# EAGLE design Balancer 4S (EAGLE 7.7.0)
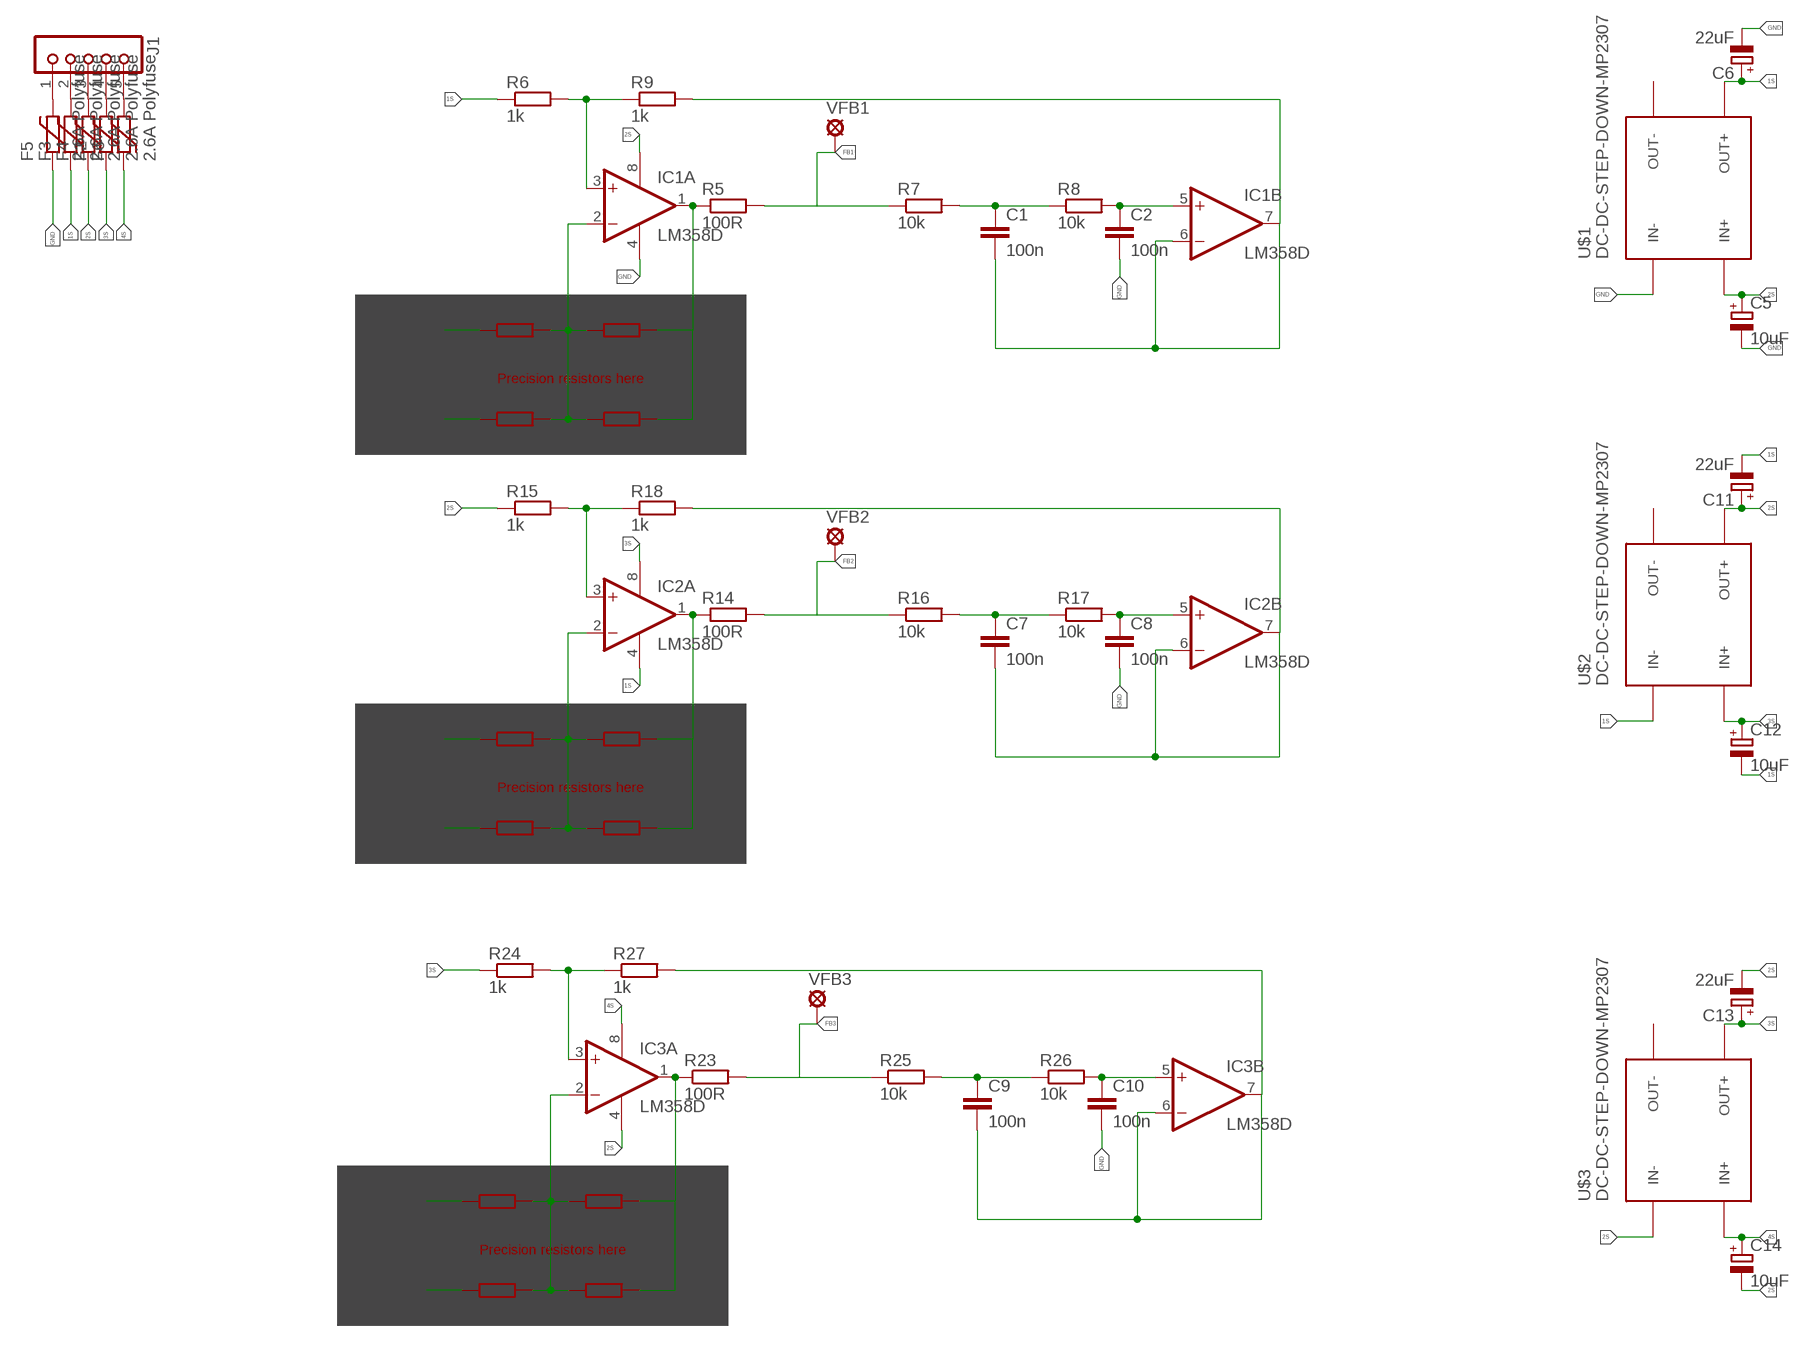
[diagram p0: schematic, sheet 1]

## Parts
C1  100n  C-EUC0805K  [C0805K]
C2  100n  C-EUC0805K  [C0805K]
C5  10uF  CPOL-EUE2,5-6E  [E2,5-6E]
C6  22uF  CPOL-EUE2,5-6E  [E2,5-6E]
C7  100n  C-EUC0805K  [C0805K]
C8  100n  C-EUC0805K  [C0805K]
C9  100n  C-EUC0805K  [C0805K]
C10  100n  C-EUC0805K  [C0805K]
C11  22uF  CPOL-EUE2,5-6E  [E2,5-6E]
C12  10uF  CPOL-EUE2,5-6E  [E2,5-6E]
C13  22uF  CPOL-EUE2,5-6E  [E2,5-6E]
C14  10uF  CPOL-EUE2,5-6E  [E2,5-6E]
F2  2.6A Polyfuse  1812L  [1812L]
F3  2.6A Polyfuse  1812L  [1812L]
F4  2.6A Polyfuse  1812L  [1812L]
F5  2.6A Polyfuse  1812L  [1812L]
F6  2.6A Polyfuse  1812L  [1812L]
IC1  LM358D  [SO08]
IC2  LM358D  [SO08]
IC3  LM358D  [SO08]
J1  JU05  [JU05]
R1  1k  R-EU_0204/7  [0204/7]
R2  1k  R-EU_0204/7  [0204/7]
R3  1k  R-EU_0204/7  [0204/7]
R4  1k  R-EU_0204/7  [0204/7]
R5  100R  R-EU_M0805  [M0805]
R6  1k  R-EU_M0805  [M0805]
R7  10k  R-EU_M0805  [M0805]
R8  10k  R-EU_M0805  [M0805]
R9  1k  R-EU_M0805  [M0805]
R10  1k  R-EU_0204/7  [0204/7]
R11  1k  R-EU_0204/7  [0204/7]
R12  1k  R-EU_0204/7  [0204/7]
R13  1k  R-EU_0204/7  [0204/7]
R14  100R  R-EU_M0805  [M0805]
R15  1k  R-EU_M0805  [M0805]
R16  10k  R-EU_M0805  [M0805]
R17  10k  R-EU_M0805  [M0805]
R18  1k  R-EU_M0805  [M0805]
R19  1k  R-EU_0204/7  [0204/7]
R20  1k  R-EU_0204/7  [0204/7]
R21  1k  R-EU_0204/7  [0204/7]
R22  1k  R-EU_0204/7  [0204/7]
R23  100R  R-EU_M0805  [M0805]
R24  1k  R-EU_M0805  [M0805]
R25  10k  R-EU_M0805  [M0805]
R26  10k  R-EU_M0805  [M0805]
R27  1k  R-EU_M0805  [M0805]
U$1  DC-DC-STEP-DOWN-MP2307  [DC-DC-STEP-DOWN-MP2307]
U$2  DC-DC-STEP-DOWN-MP2307  [DC-DC-STEP-DOWN-MP2307]
U$3  DC-DC-STEP-DOWN-MP2307  [DC-DC-STEP-DOWN-MP2307]
VFB1  MCS08  [MCS08]
VFB2  MCS08  [MCS08]
VFB3  MCS08  [MCS08]

## Nets
1S: C6.+ C11.- C12.- F3.P$1 IC2.4(P:V-) R6.1 R12.1 U$1.OUT+ U$2.IN-
2S: C5.+ C11.+ C13.- C14.- F4.P$1 IC1.8(P:V+) IC3.4(P:V-) R1.1 R15.1 R21.1 U$1.IN+ U$2.OUT+ U$3.IN-
3S: C12.+ C13.+ F2.P$1 IC2.8(P:V+) R10.1 R24.1 U$2.IN+ U$3.OUT+
4S: C14.+ F6.P$1 IC3.8(P:V+) R19.1 U$3.IN+
FB1: R5.2 R7.1 VFB1.MP
FB2: R14.2 R16.1 VFB2.MP
FB3: R23.2 R25.1 VFB3.MP
GND: C2.2 C5.- C6.- C8.2 C10.2 F5.P$1 IC1.4(P:V-) R3.1 U$1.IN-
N$1: IC1.3(A:+IN) R6.2 R9.1
N$2: F5.P$2 J1.1
N$3: IC1.2(A:-IN) R1.2 R2.1 R3.2 R4.1
N$4: IC1.1(A:OUT) R2.2 R4.2 R5.1
N$5: C1.1 R7.2 R8.1
N$6: C2.1 IC1.5(B:+IN) R8.2
N$7: C1.2 IC1.6(B:-IN) IC1.7(B:OUT) R9.2
N$8: F4.P$2 J1.3
N$9: F3.P$2 J1.2
N$10: F2.P$2 J1.4
N$11: F6.P$2 J1.5
N$12: IC2.3(A:+IN) R15.2 R18.1
N$13: IC2.2(A:-IN) R10.2 R11.1 R12.2 R13.1
N$14: IC2.1(A:OUT) R11.2 R13.2 R14.1
N$17: C7.1 R16.2 R17.1
N$18: C8.1 IC2.5(B:+IN) R17.2
N$19: C7.2 IC2.6(B:-IN) IC2.7(B:OUT) R18.2
N$20: IC3.3(A:+IN) R24.2 R27.1
N$21: IC3.2(A:-IN) R19.2 R20.1 R21.2 R22.1
N$22: IC3.1(A:OUT) R20.2 R22.2 R23.1
N$23: C9.1 R25.2 R26.1
N$24: C10.1 IC3.5(B:+IN) R26.2
N$25: C9.2 IC3.6(B:-IN) IC3.7(B:OUT) R27.2
Unconnected: U$1.OUT- U$2.OUT- U$3.OUT-

## Notes on the sheet
- Precision resistors here
- Precision resistors here
- Precision resistors here | Precision resistors here | Precision resistors here | Precision resistors here | Precision resistors here | Precision resistors here | Precision resistors here | Precision resistors here | Precision resistors here | Precision resistors here | Precision resistors here | Precision resistors here
- Precision resistors here
- Precision resistors here
- Precision resistors here | Precision resistors here | Precision resistors here | Precision resistors here | Precision resistors here | Precision resistors here | Precision resistors here | Precision resistors here | Precision resistors here | Precision resistors here | Precision resistors here | Precision resistors here
- Precision resistors here
- Precision resistors here
- Precision resistors here | Precision resistors here | Precision resistors here | Precision resistors here | Precision resistors here | Precision resistors here | Precision resistors here | Precision resistors here | Precision resistors here | Precision resistors here | Precision resistors here | Precision resistors here

## Library data of the parts
C1 C2 C7-C10 = rcl:C-EU: CAPACITOR, European symbol
C5 C6 C11-C14 = rcl:CPOL-EU: POLARIZED CAPACITOR, European symbol
F2-F6 = ptc-littlefuse:1812L
IC1-IC3 = linear:LM358: OP AMP also LM158; LM258; LM2904 Source: http://cache.national.com/ds/LM/LM158.pdf
J1 = con-lsta:JU05: PIN HEADER; OC_FARNELL: unknown; OC_NEWARK: unknown
R1-R4 R10-R13 R19-R22 = resistor:R-EU_: RESISTOR, European symbol
R5-R9 R14-R18 R23-R27 = rcl:R-EU_: RESISTOR, European symbol
U$1-U$3 = diy-modules:DC-DC-STEP-DOWN-MP2307: DC/DC Step-Down Regulator based on MP2307DN chip MP2307 datasheet available here: https://cdn-shop.adafruit.com/datasheets/MP2307_r1.9.pdf Click here to find device on ebay.com <http://www.ebay.com/sch/dc+dc+3a+mini+converter>
VFB1-VFB3 = solpad:MCS08: SOLDER PAD MC S0,8, drill 1.2 mm, distributor Buerklin, 08F130

## Net classes
0 default: width 0.254 mm, drill 0.55 mm, clearance 0.381 mm

## Board
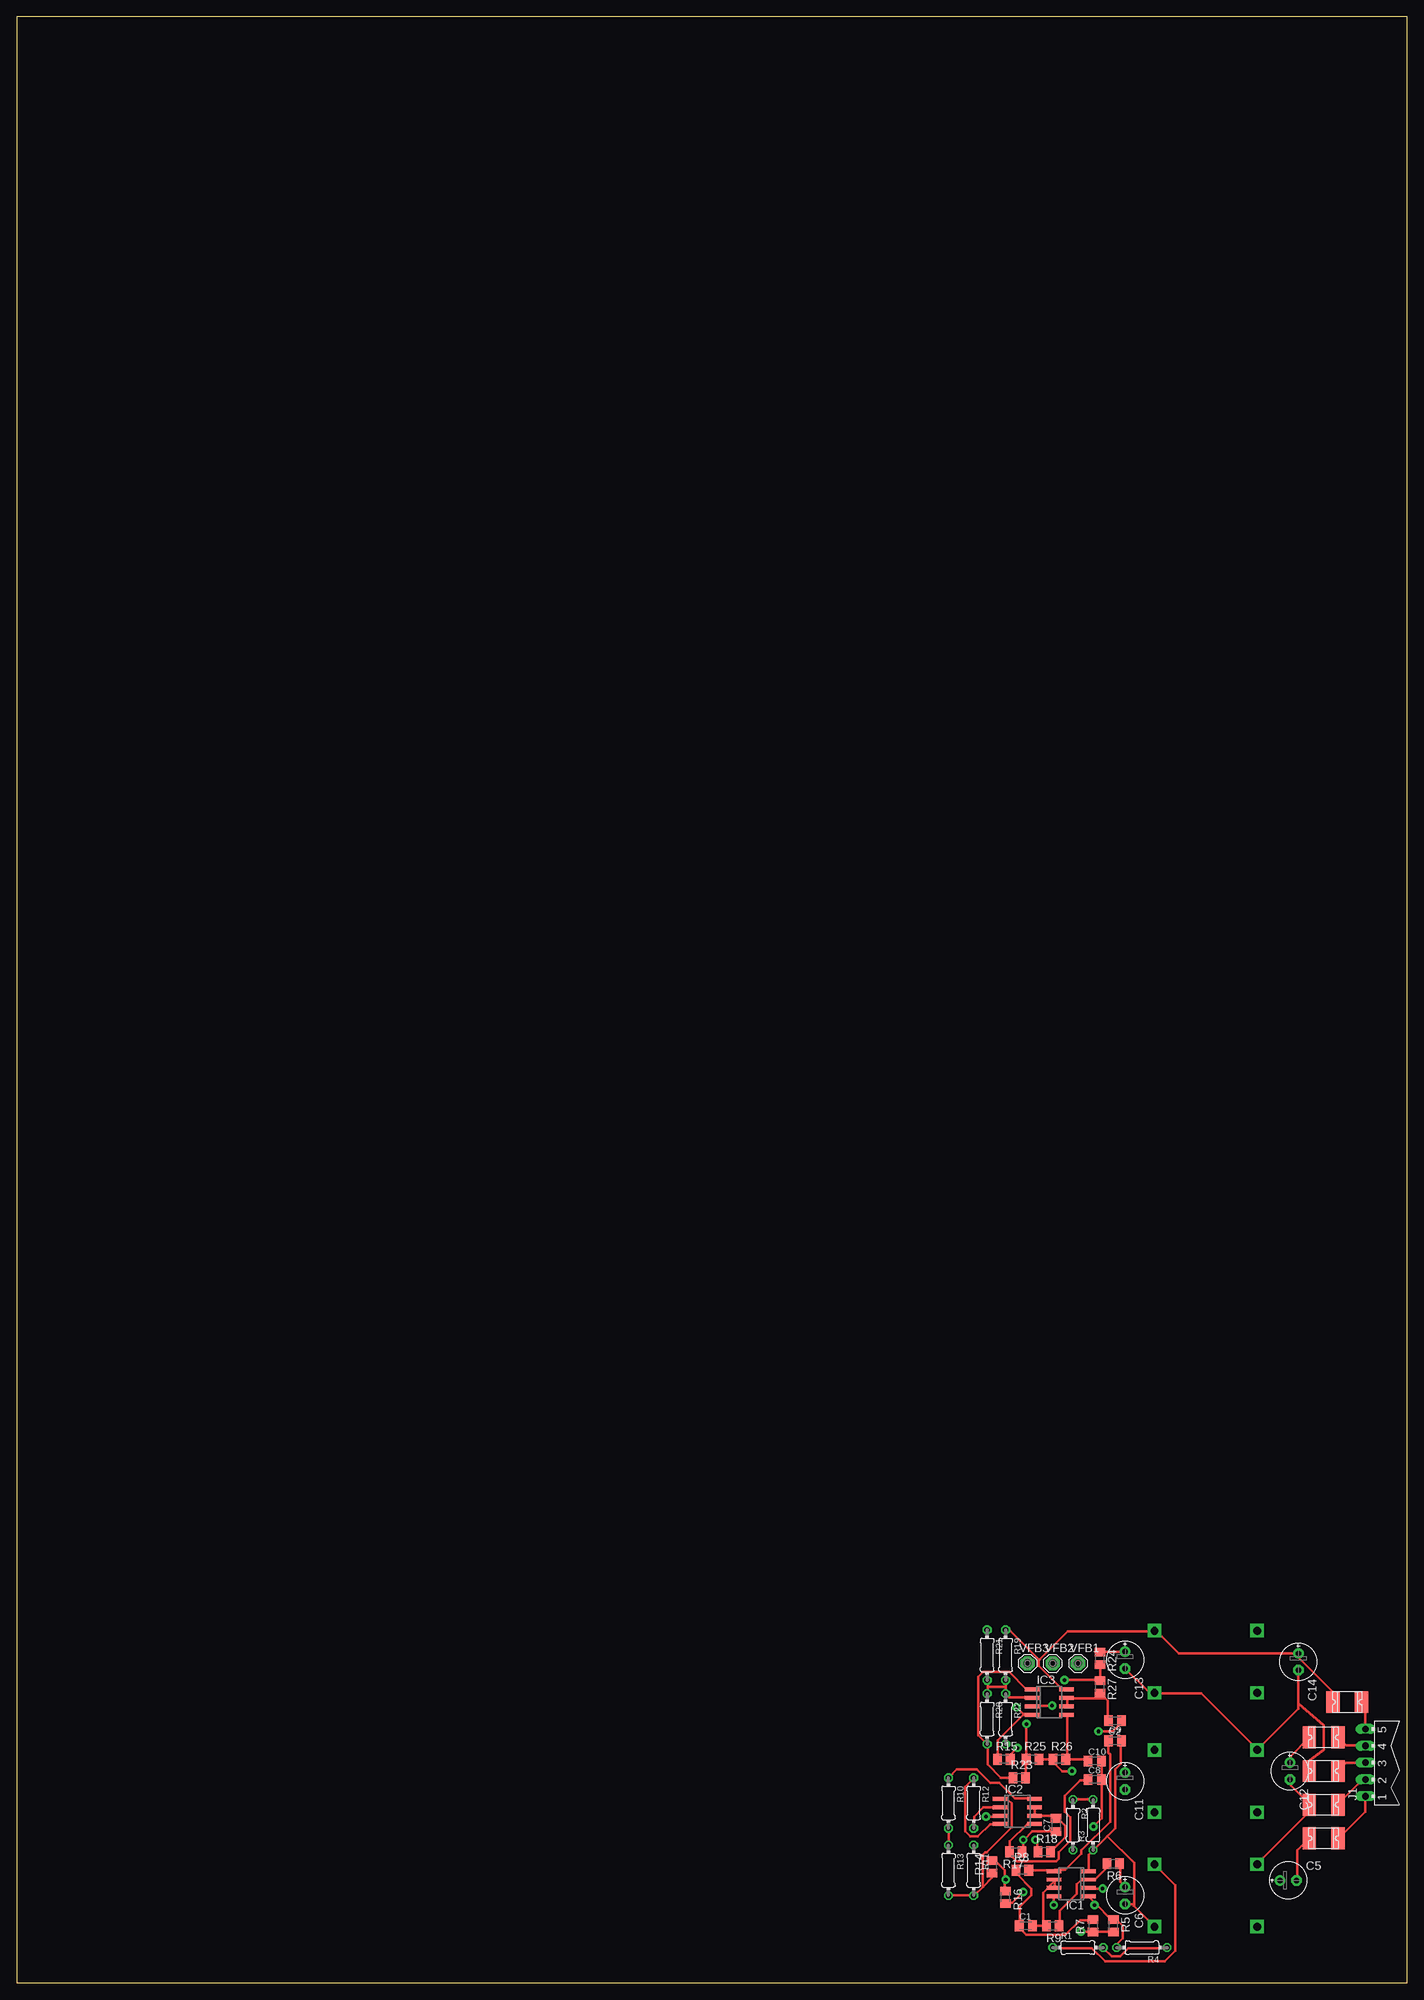
[diagram p1: board, top side]
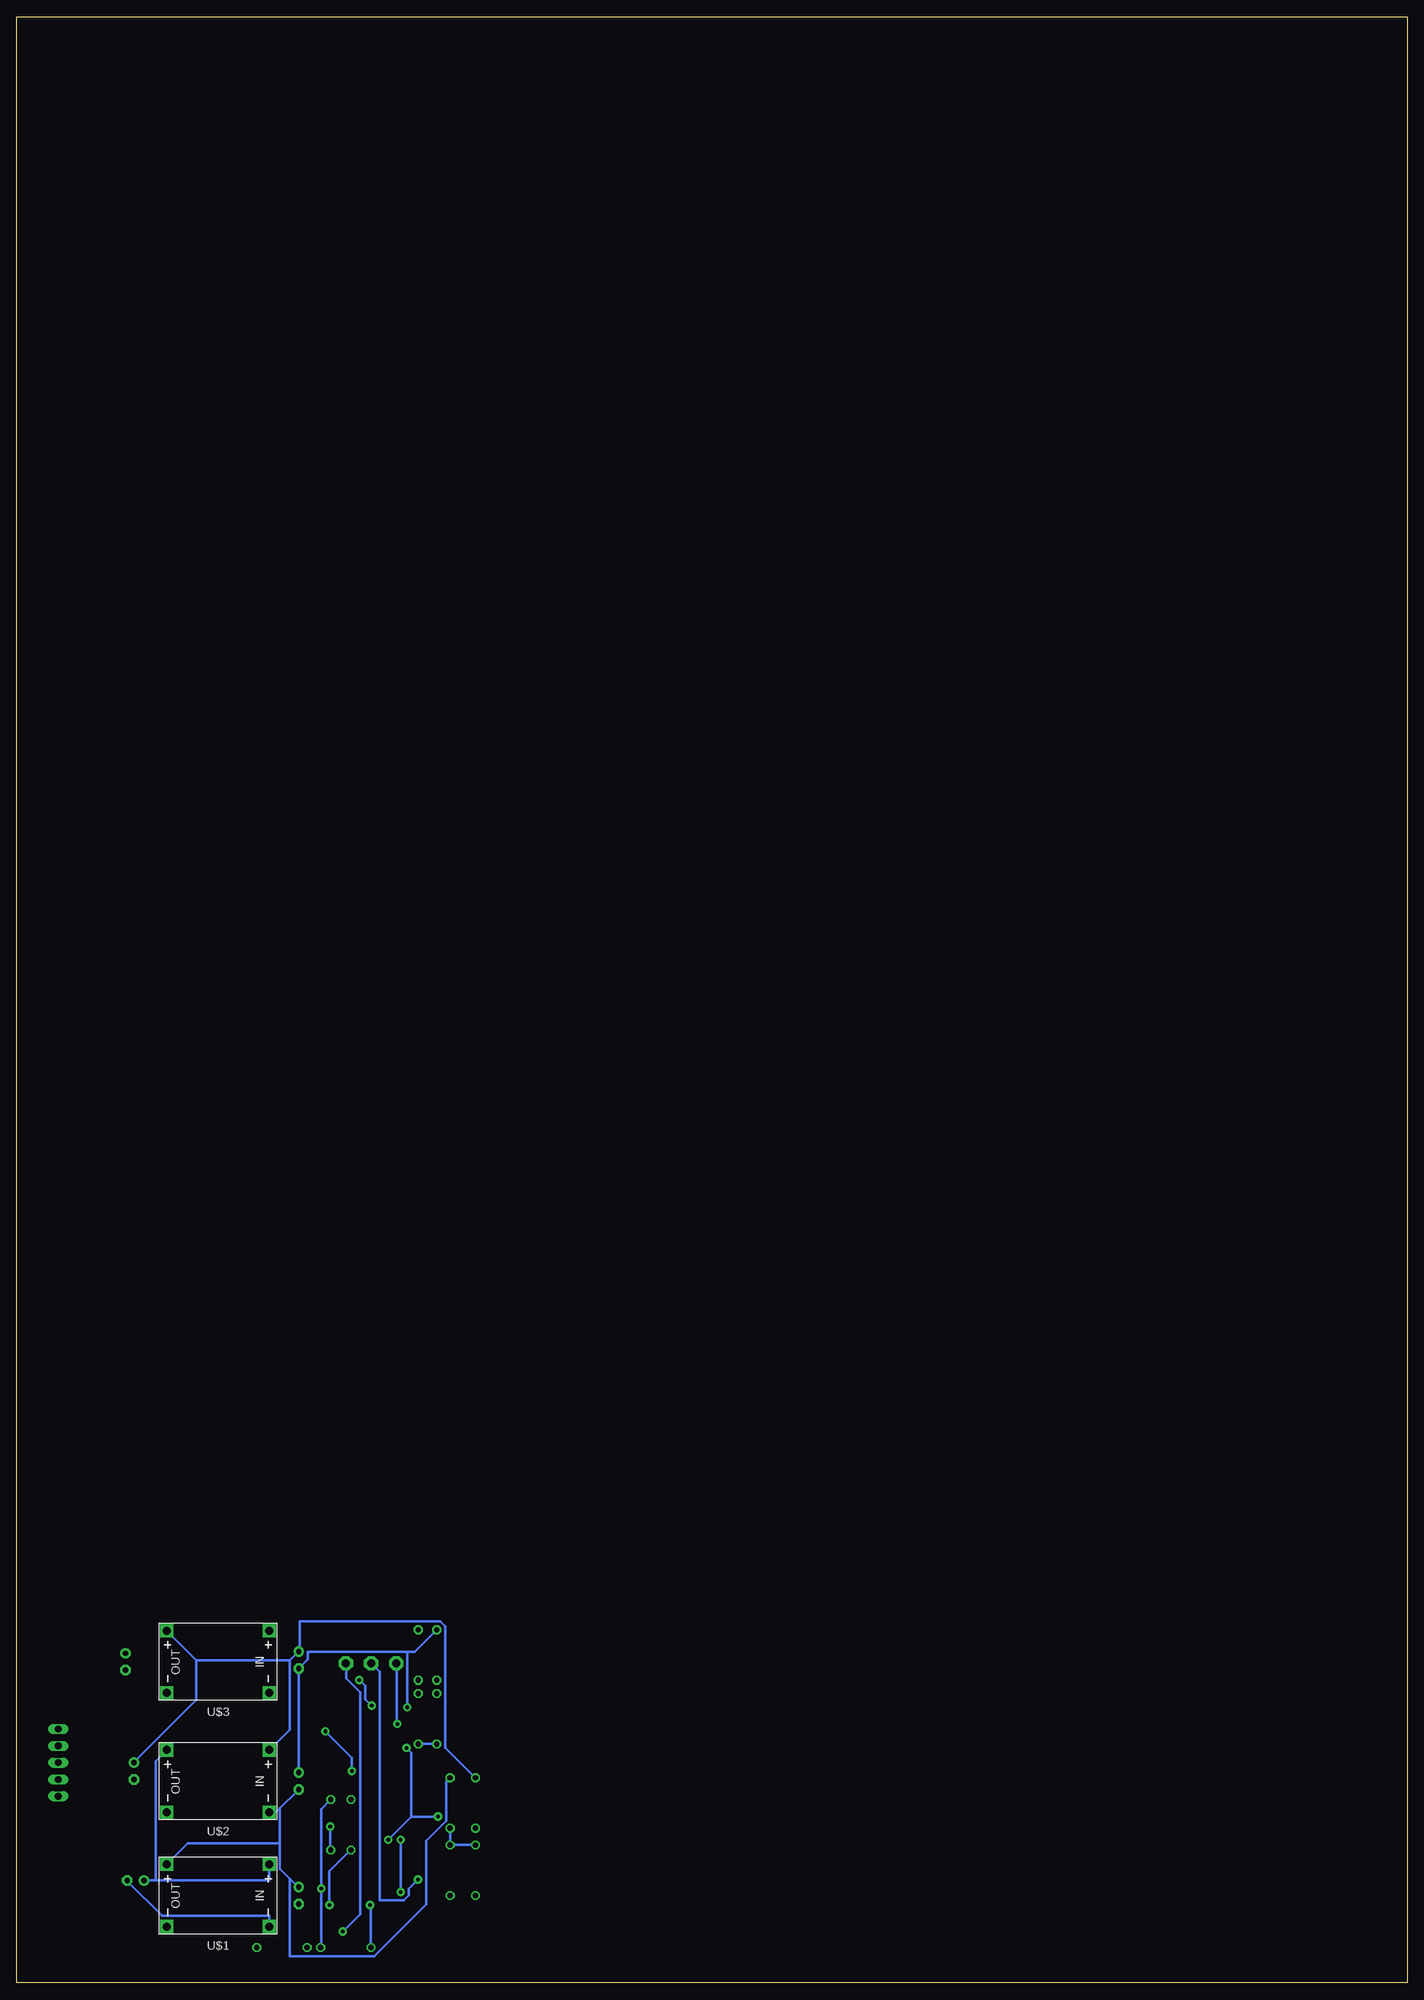
[diagram p2: board, bottom side, seen from below]

Size 210 x 297 mm. Coordinates in mm from the lower left corner, seen from the top.
Outline: 0,0 210,0 210,297 0,297 0,0
Copper layers (1*16): Top 0.035mm / dielectric 1.5mm / Bottom 0.035mm
Design rules "default *": minimum track width 0.35mm, minimum drill 0.526mm, track to track 0.3mm, track to pad 0.35mm, pad to pad 0.3mm, via to via 0.35mm, smd to smd 8mil, copper to edge 40mil, drill to drill 8mil, minimum pad ring 10mil, minimum via ring 0.35mm, stop-mask expansion 4mil, vias tented up to drill 0mil, thermal gap 10mil

### Footprints (pad centres in the part's own frame; a part is rotated, then mirrored left to right if it is on the bottom)
C0805K = smd 1.3 x 1.6: 1 -1,0; 2 1,0
E2,5-6E = drill 0.813 pad 1.575: + -1.27,0 | drill 0.813 pad 1.575 octagon: - 1.27,0
1812L = smd 2.03 x 3.3: P$1 -2.16,0; P$2 2.16,0
SO08 = smd 0.6 x 2.2: 1 -1.905,-2.6; 2 -0.635,-2.6; 3 0.635,-2.6; 4 1.905,-2.6; 5 1.905,2.6; 6 0.635,2.6; 7 -0.635,2.6; 8 -1.905,2.6
JU05 = drill 1.016 long: 1 -5.08,0; 2 -2.54,0; 3 0,0; 4 2.54,0; 5 5.08,0
0204/7 = drill 0.813 octagon: 1 -3.81,0; 2 3.81,0
M0805 = smd 1.3 x 1.6: 1 -0.95,0; 2 0.95,0
DC-DC-STEP-DOWN-MP2307 = drill 1.2 pad 2 square: IN+ -7.747,-4.699; IN- -7.747,4.699; OUT+ 7.747,-4.699; OUT- 7.747,4.699
MCS08 = drill 1.194 pad 2.159 octagon: MP 0,0

### Placement (x,y rotation side)
C1  152.4,8.64 0 top
C2  165.86,36.58 0 top
C5  192.02,15.49 0 top
C6  167.39,13.21 270 top
C7  156.97,23.88 90 top
C8  162.81,30.73 0 top
C9  165.86,39.62 180 top
C10  162.81,33.53 0 top
C11  167.39,30.48 270 top
C12  192.28,32 270 top
C13  167.39,48.77 270 top
C14  193.55,48.51 270 top
F2  197.36,37.08 0 top
F3  197.36,26.92 0 top
F4  197.36,32 0 top
F5  197.36,21.84 0 top
F6  200.91,42.42 0 top
IC1  159.26,14.99 90 top
IC2  151.13,25.91 270 top
IC3  155.96,42.42 270 top
J1  203.71,33.27 90 top
R1  160.27,5.33 0 top
R2  159.51,23.88 270 top
R3  162.56,23.88 90 top
R4  169.93,5.33 180 top
R5  165.61,8.64 270 top
R6  165.61,18.03 180 top
R7  162.56,8.64 90 top
R8  151.89,17.02 0 top
R9  156.46,8.64 180 top
R10  140.72,27.18 270 top
R11  144.53,17.02 270 top
R12  144.53,27.18 270 top
R13  140.72,17.02 270 top
R14  147.32,17.53 90 top
R15  149.1,33.78 0 top
R16  149.35,12.95 270 top
R17  150.88,19.81 180 top
R18  155.19,19.81 0 top
R19  149.35,49.53 270 top
R20  146.56,39.88 270 top
R21  146.56,49.53 270 top
R22  149.35,39.88 270 top
R23  151.38,30.99 0 top
R24  163.58,49.02 270 top
R25  153.42,33.78 0 top
R26  157.48,33.78 0 top
R27  163.58,44.7 270 top
U$1  179.58,13.21 180 bottom
U$2  179.58,30.48 180 bottom
U$3  179.58,48.51 180 bottom
VFB1  160.27,48.26 0 top
VFB2  156.46,48.26 0 top
VFB3  152.65,48.26 0 top

### Tracks (layer width: path | path; a pad name or v marks a point on that pad's centre or on a via)
1S
  Top 0.35: C12.- 192.38,30.62 192.38,29.88 195.12,27.12 F3.P$1 195,25.88 195,25.62 187.38,18 U$1.OUT+ | IC2.4 148.5,24 147,24 145.12,22.12 144,22.12 143.25,22.88 143.25,29.62 144.5,30.88 R12.1 | R6.1 166.62,18 166.62,15.25 167.38,14.5 C6.+
  Top 0.508: F3.P$1 195.2,26.04
  Bottom 0.35: 170.31,26.31 170.75,25.88 171.75,25.88 U$2.IN- | 170.31,26.31 167.5,29.12 C11.- | 168.69,15.69 170.25,17.25 170.25,21.12 | 168.69,15.69 167.5,14.5 C6.+ | 170.25,21.12 170.25,26.25 170.31,26.31 | R12.1 144.62,30.88 145.12,30.38 145.12,24.5 148.12,21.5 148.12,11.88 156,4 168.75,4 168.75,15.62 168.69,15.69 | 170.25,21.12 184.12,21.12 187.25,18 U$1.OUT+
2S  (via drill 0.55)
  Top 0.35: 152,40.5 148.12,36.62 148.12,33.88 R15.1 | 152,40.5 153.25,40.5 IC3.4 | C13.- 167.5,47.38 171,43.88 171.75,43.88 U$3.IN- 172,43.75 178.88,43.75 187.25,35.38 U$2.OUT+ 187.38,35.25 193.5,41.38 193.5,42.12 | v151,41.62 152,40.62 152,40.5 | 193.5,42.12 193.5,47.12 C14.- | F4.P$1 195.25,32.12 195.25,33.62 197.38,35.25 197.38,38.88 193.62,42.12 193.5,42.12 | v156.62,11.75 156.62,13 IC1.8 | R1.1 156.5,5.25 162.38,5.25 164.38,3.25 173.38,3.25 175,4.88 175,14.75 171.88,17.88 U$1.IN+
  Bottom 0.35: 151,50 166,50 166,48.88 167.38,47.5 C13.- 167.38,47.38 167.38,31.75 C11.+ | 151,50 149.88,50 146.62,53.25 R21.1 | 151,50 v151,41.62 | v156.62,11.75 156.5,11.62 156.5,5.38 R1.1 | 189,15.5 171.88,15.5 171.88,17.88 U$1.IN+ | 189,15.5 C5.+ | 189,15.5 189,33.5 187.38,35.12 U$2.OUT+
3S
  Top 0.35: IC2.8 153.62,27.88 150.75,27.88 148.38,30.25 147,30.25 145,32.25 142,32.25 140.75,31 R10.1 | C12.+ 192.38,33.38 192.38,34.25 195.12,37 F2.P$1 | R24.1 163.62,50 167.38,50 C13.+
  Bottom 0.35: 168.75,48.75 168.75,38.25 171.75,35.25 U$2.IN+ | 168.75,48.75 167.5,50 C13.+ 167.25,50.12 167.25,54.62 146,54.62 145.25,53.88 145.25,35.5 140.75,31 R10.1 | 182.88,48.75 187.25,53.12 U$3.OUT+ | 168.75,48.75 182.88,48.75 | 182.88,48.75 182.88,42.75 192.25,33.38 C12.+
4S
  Top 0.35: F6.P$1 198.75,42.5 198.75,44 193.62,49.12 193.62,49.75 C14.+ 193.38,49.75 175.5,49.75 172,53.25 U$3.IN+ 171.75,53.12 158.75,53.12 154.5,48.88 154.38,48.88 | 154.38,48.88 154.38,47.88 157.88,44.38 158.5,44.38 IC3.8 | 154.38,48.88 150,53.25 149.38,53.25 R19.1
FB1  (via drill 0.55)
  Top 0.35: R5.2 165.5,7.75 162.62,7.75 R7.1 162.5,7.75 v160.75,7.75
  Bottom 0.35: v160.75,7.75 158.12,10.38 158.12,43.88 160.25,46 160.25,48.25 VFB1.MP
FB2  (via drill 0.55)
  Top 0.35: 149.25,15.62 149.25,17 147.88,18.38 147.38,18.38 R14.2 | 149.25,15.62 149.25,14 R16.1 | v149.38,15.62 149.25,15.62
  Bottom 0.35: v149.38,15.62 150.75,14.25 150.75,13.25 151.5,12.5 155.12,12.5 155.12,47 156.38,48.25 VFB2.MP
FB3  (via drill 0.55)
  Top 0.35: R23.2 152.38,31 152.38,33.75 R25.1 152.5,33.88 v152.5,39.12
  Bottom 0.35: v152.5,39.12 152.62,39.25 152.62,48.25 VFB3.MP
GND  (via drill 0.55)
  Top 0.35: C10.2 163.88,33.5 163.88,30.75 C8.2 163.88,30.62 163.88,24.88 v162.62,23.62 | 164.69,22.19 162.62,20.12 R3.1 162.5,20 161.88,19.38 161.88,17 IC1.4 | 164.69,22.19 165.88,23.38 165.88,32.25 166.75,33.12 166.75,36.5 C2.2 | C5.- 193.38,15.5 193.38,20 195.12,21.75 F5.P$1 | 168.69,11.69 171.75,8.62 U$1.IN- | 168.69,11.69 168.5,11.88 167.5,11.88 C6.- | 164.69,22.19 168.75,18.12 168.75,11.75 168.69,11.69
  Bottom 0.35: v162.62,23.62 162.62,20.12 R3.1 | C5.- 193.25,15.38 188,10.12 171.88,10.12 171.88,8.62 U$1.IN-
N$1
  Top 0.35: R9.1 157.5,8.75 157.5,10.88 160.12,13.5 160.12,14.88 160.75,15.5 161.75,15.5 IC1.3 162,15.62 162.88,15.62 164.62,17.38 164.62,18 R6.2
N$2
  Top 0.35: J1.1 203.62,28.12 203.62,25.88 199.62,21.88 F5.P$2
N$3  (via drill 0.55)
  Top 0.35: R2.1 159.62,27.75 162.5,27.75 R3.2 | v164,14.25 161.88,14.25 IC1.2 | R4.1 173.62,5.25 167.88,5.25 166.62,4 165.38,4 164.12,5.25 R1.2
  Bottom 0.35: R1.2 164,5.38 v164,14.25 164,26.25 162.62,27.62 R3.2
N$4  (via drill 0.55)
  Top 0.35: 162.94,11.94 161.88,13 IC1.1 | 162.94,11.94 165.25,9.62 165.5,9.62 R5.1 165.75,9.5 166.12,9.5 167,8.62 167,6.75 166.12,5.88 166.12,5.38 R4.2 | 162.94,11.94 v162.75,11.75
  Bottom 0.35: v162.75,11.75 162.75,16.88 159.62,20 R2.2
N$5
  Top 0.35: R8.1 151,17 151,16.5 153.25,14.25 153.25,13.25 151.5,11.5 151.5,8.75 C1.1 151.5,8.5 151.5,8.25 152.5,7.25 158.38,7.25 160.62,9.5 162.5,9.5 R7.2
N$6
  Top 0.35: R8.2 152.88,17 156.62,17 IC1.5 156.75,17.12 158.38,17.12 160.75,19.5 160.75,20 165.12,24.38 165.12,34.5 164.88,34.75 164.88,36.5 C2.1
N$7
  Top 0.35: C1.2 153.5,8.62 155.5,8.62 R9.2 155,8.75 155,13.62 156.62,15.25 156.75,15.25 | 156.75,15.25 156.75,15.5 IC1.6 | 156.75,15.25 156.75,14.38 IC1.7
N$8
  Top 0.35: J1.3 203.62,33.25 200.75,33.25 199.62,32.12 F4.P$2
N$9
  Top 0.35: J1.2 203.12,30.62 199.5,27 F3.P$2
  Top 0.508: 203.33,30.73 J1.2
N$10
  Top 0.35: J1.4 203.62,35.88 200.75,35.88 199.62,37 F2.P$2
N$11
  Top 0.35: J1.5 203.62,38.38 203.62,41.88 203.12,42.38 F6.P$2
N$12  (via drill 0.55)
  Top 0.35: v153.88,21.62 154.12,21.38 154.12,19.88 R18.1 | v146.38,25.12 148.38,25.12 148.5,25.25 IC2.3 | v151.12,35.5 150.12,34.5 150.12,33.88 R15.2
  Bottom 0.35: 150.38,25.12 v153.88,21.62 | v146.38,25.12 150.38,25.12 | v151.12,35.5 150.38,34.75 150.38,25.12
N$13
  Top 0.35: R13.1 140.75,20.88 140.75,23.25 R10.2 | IC2.2 148.5,26.5 146,26.5 144.62,25.12 144.62,23.38 R12.2
  Bottom 0.35: R12.2 144.5,23.25 144.5,20.88 R11.1 144.38,20.88 140.75,20.88 R13.1
N$14
  Top 0.35: 145.94,14.56 144.62,13.25 R11.2 144.38,13.25 140.75,13.25 R13.2 | 145.94,14.56 147.25,15.88 147.25,16.5 R14.1 | IC2.1 148.62,27.75 149.62,27.75 150.25,27.12 150.25,23.5 146.5,19.75 146.25,19.75 145.88,19.38 145.88,14.62 145.94,14.56
N$17  (via drill 0.55)
  Top 0.35: v152,13.75 150.38,12.12 149.38,12.12 R16.2 | R17.1 151.88,19.88 152,20 v152,21.62 152.12,21.62 153.38,22.88 156.88,22.88 C7.1
  Bottom 0.35: v152,21.62 v152,13.75
N$18
  Top 0.35: IC2.5 153.62,24 152.62,24 150,21.38 150,19.88 R17.2 150,19.75 150,19.38 151,18.38 157,18.38 157.38,18.75 157.38,19.75 159.12,21.5 159.12,25 158.25,25.88 158.25,28.25 160.62,30.62 161.75,30.62 C8.1
N$19
  Top 0.35: IC2.7 153.75,26.5 153.75,25.38 IC2.6 153.88,25.25 156.62,25.25 156.88,25 C7.2 157,24.88 157.25,24.88 158.38,23.75 158.38,22 156.25,19.88 R18.2
N$20  (via drill 0.55)
  Top 0.35: R24.2 163.62,48 163.62,45.75 R27.1 163.5,45.75 v158.25,45.75 | v156.38,41.88 153.38,41.88 IC3.3
  Bottom 0.35: v156.38,41.88 157.38,42.88 157.38,44.88 v158.25,45.75
N$21
  Top 0.35: 146.62,44.75 146.62,45.62 R21.2 | 146.62,44.75 146.62,43.75 R20.1 | IC3.2 153.25,43.12 149.88,43.12 149.38,43.62 R22.1 149.38,43.75 149.38,44.75 | 149.38,44.75 149.38,45.62 R19.2 | 149.38,44.75 146.62,44.75
N$22
  Top 0.35: R23.1 150.38,31 148.62,31 146.62,33 146.62,36 R20.2 146.5,36.12 145.25,37.38 145.25,46.25 146,47 149.88,47 152.5,44.38 153.25,44.38 IC3.1
  Bottom 0.35: R22.2 149.25,36.12 146.62,36.12 R20.2
N$23  (via drill 0.55)
  Top 0.35: R25.2 154.38,33.75 156.5,33.75 R26.1 156.25,33.62 157.88,32 v159.38,32 | v163.38,38 165.5,38 166.75,39.25 166.75,39.5 C9.1
  Bottom 0.35: v163.38,38 159.38,34 v159.38,32
N$24
  Top 0.35: C10.1 161.75,33.62 161.62,33.75 158.5,33.75 R26.2 158.62,33.88 158.62,40.5 IC3.5
N$25
  Top 0.35: IC3.6 158.62,41.88 158.62,43 IC3.7 158.75,43 164.25,43 164.31,43.06 | 164.31,43.06 163.62,43.75 R27.2 | 164.31,43.06 164.75,42.62 164.75,39.62 C9.2